# Altium schematic sheet 12.RK3568_OSCPLLPMUIO.SchDoc
size 420 x 297 mm
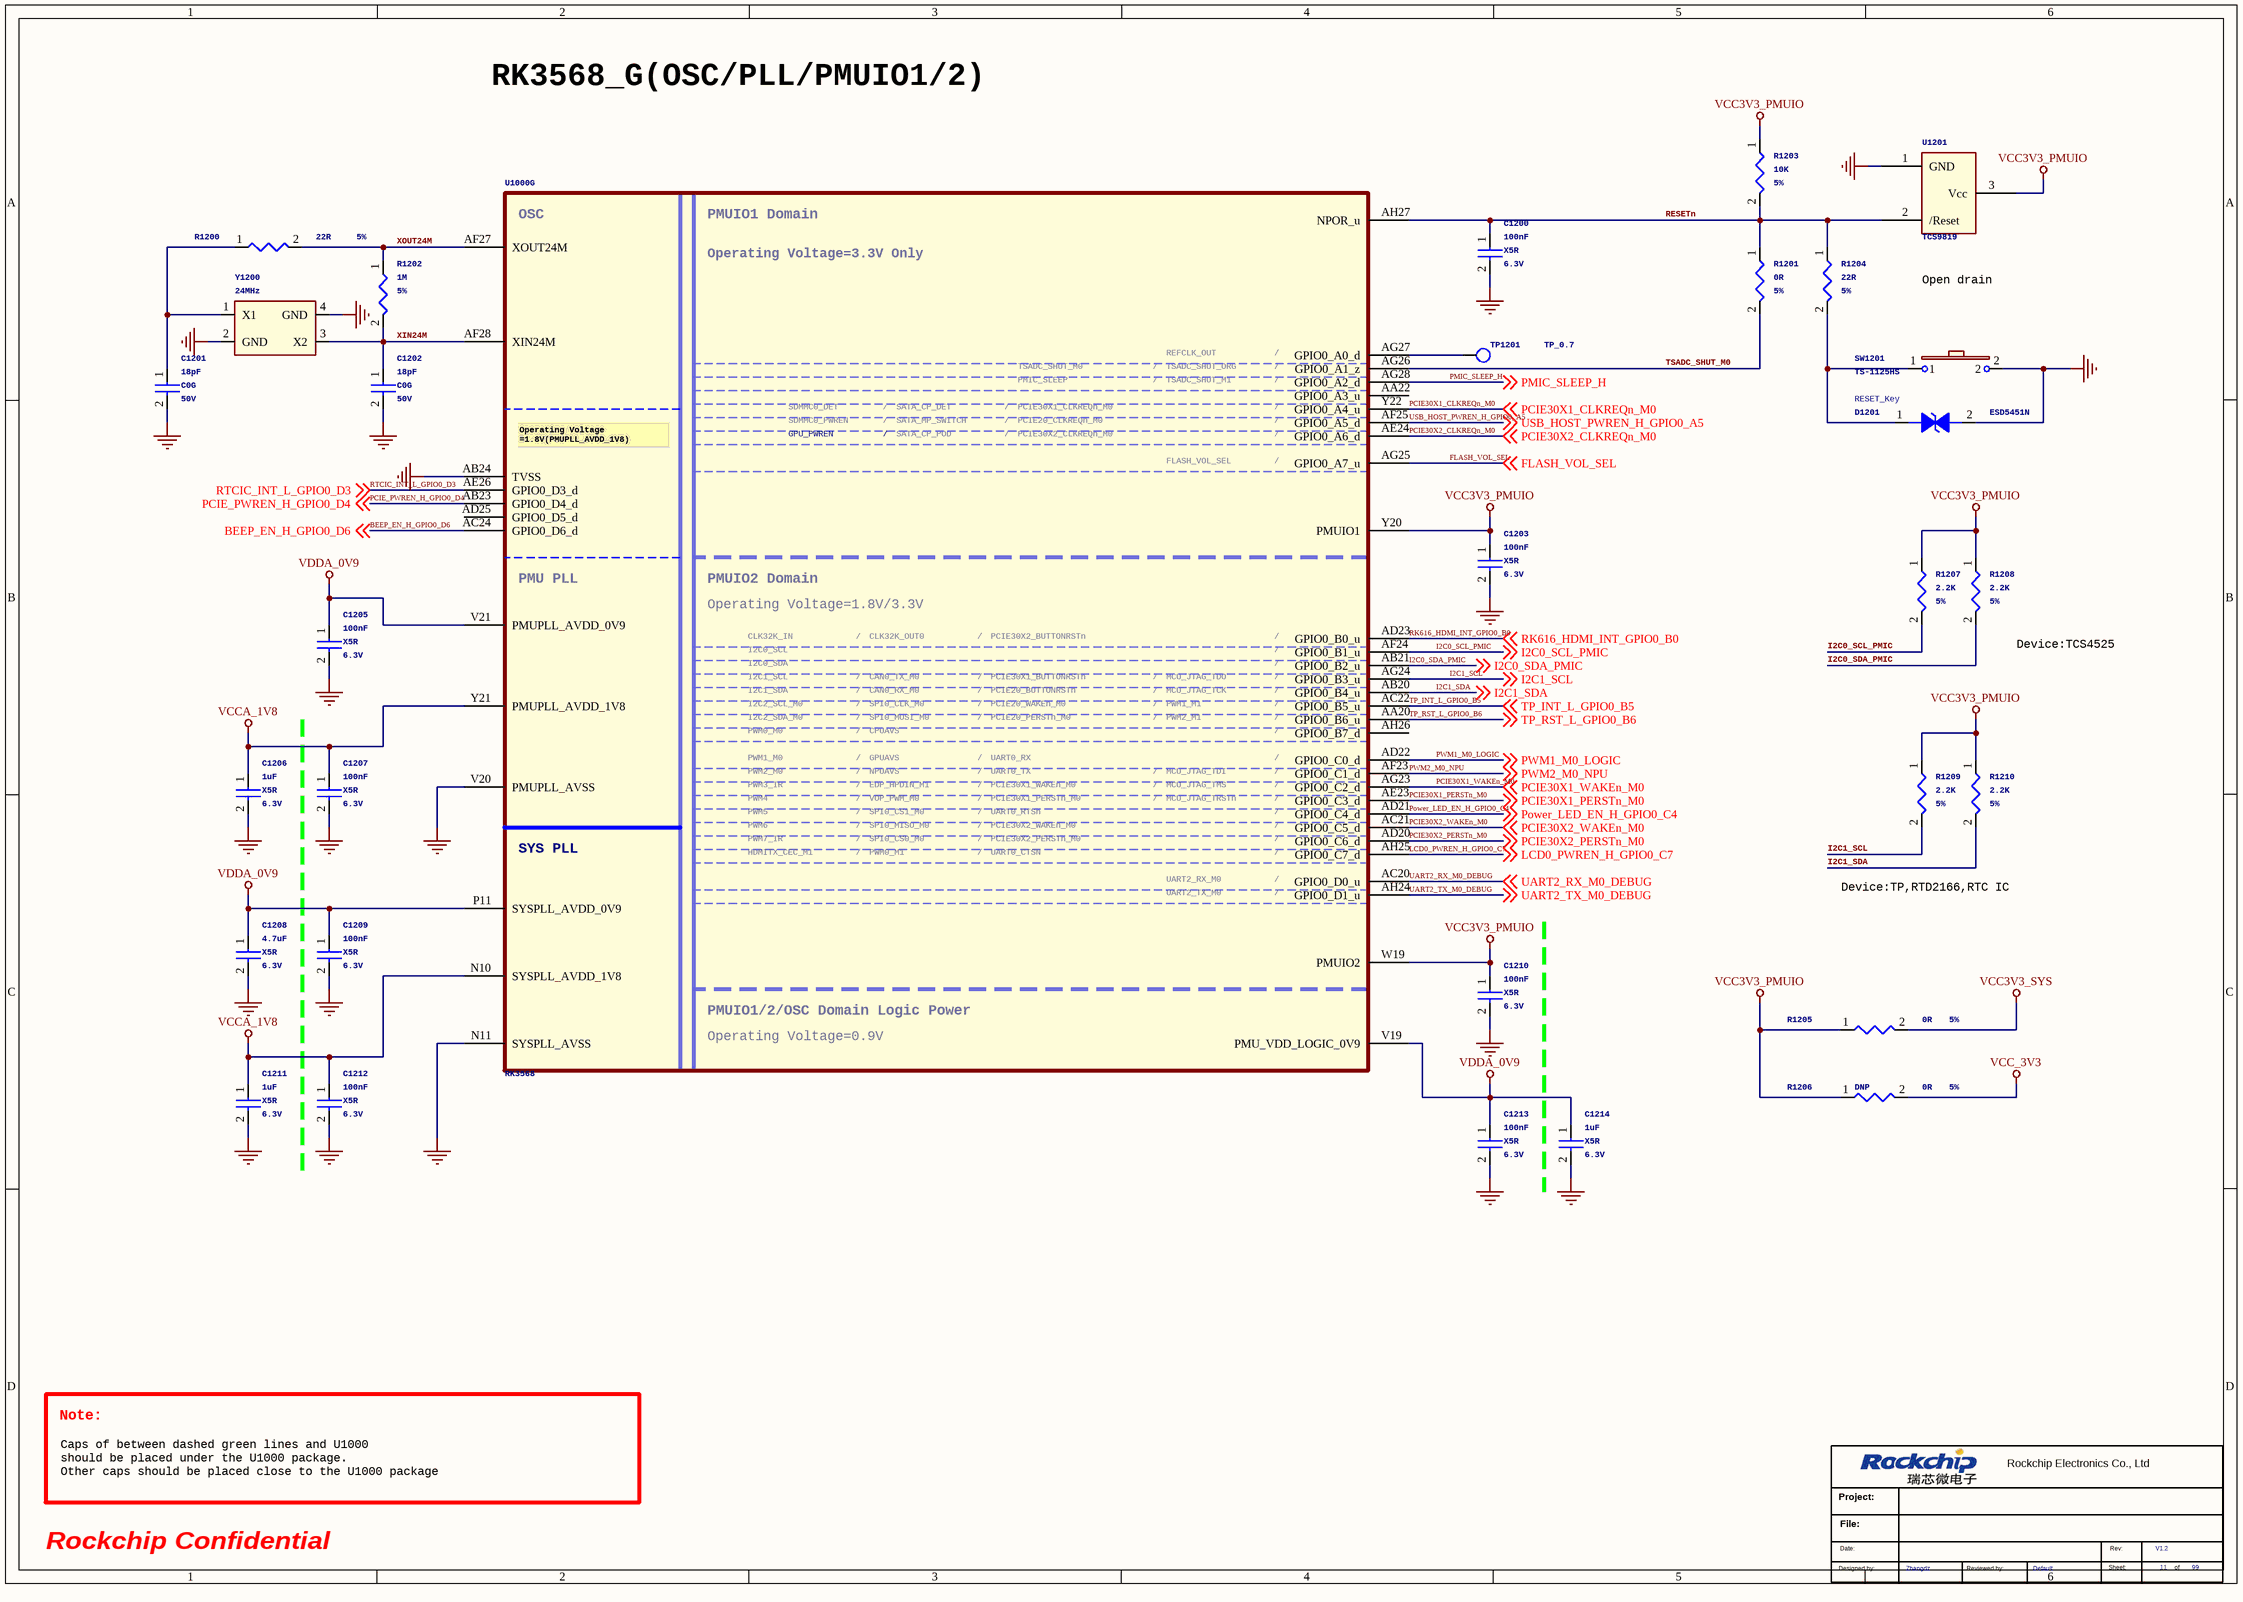
[diagram p0: 12.RK3568_OSCPLLPMUIO.SchDoc]

## Parts
*  Schematic Page Count: 99  Schematic Page Number: 11  Designer: Zhangdz  Revision: V1.2  Check: Default  (hidden comment: Rockchip_new)  (graphical)
C1200  100nF  Voltage: 6.3V  Dielectric: X5R  [C0201]
C1201  18pF  Voltage: 50V  Dielectric: C0G  [C0402]
C1202  18pF  Voltage: 50V  Dielectric: C0G  [C0402]
C1203  100nF  Voltage: 6.3V  Dielectric: X5R  [C0201]
C1205  100nF  Voltage: 6.3V  Dielectric: X5R  [C0201]
C1206  1uF  Voltage: 6.3V  Dielectric: X5R  [C0402]
C1207  100nF  Voltage: 6.3V  Dielectric: X5R  [C0201]
C1208  4.7uF  Voltage: 6.3V  Dielectric: X5R  [C0402]
C1209  100nF  Voltage: 6.3V  Dielectric: X5R  [C0201]
C1210  100nF  Voltage: 6.3V  Dielectric: X5R  [C0201]
C1211  1uF  Voltage: 6.3V  Dielectric: X5R  [C0402]
C1212  100nF  Voltage: 6.3V  Dielectric: X5R  [C0201]
C1213  100nF  Voltage: 6.3V  Dielectric: X5R  [C0201]
C1214  1uF  Voltage: 6.3V  Dielectric: X5R  [C0402]
D1201  ESD5451N  [ESD0402]
R1200  22R  Tolerance: 5%  [R0402]
R1201  0R  Tolerance: 5%  [R0402]
R1202  1M  Tolerance: 5%  [R0402]
R1203  10K  Tolerance: 5%  [R0402]
R1204  22R  Tolerance: 5%  [R0402]
R1205  0R  Tolerance: 5%  [R0402]
R1206  0R  Tolerance: 5%  option: DNP  [R0402]
R1207  2.2K  Tolerance: 5%  [R0402]
R1208  2.2K  Tolerance: 5%  [R0402]
R1209  2.2K  Tolerance: 5%  [R0402]
R1210  2.2K  Tolerance: 5%  [R0402]
SW1201  TS-1125HS  Option: RESET_Key  [SW2_6R00X3R70X2R50]
TP1201  TP_0.7  [TP_0R70]
U1000  RK3568  [BGA636_19R00X19R00X1R20]  (part G of 23)
U1201  TCS9819  [SOT_23]
Y1200  24MHz  [CRY4_3R20X2R50X0R80]

## Nets
GND: C1200.2 C1201.2 C1202.2 C1203.2 C1205.2 C1206.2 C1207.2 C1208.2 C1209.2 C1210.2 C1211.2 C1212.2 C1213.2 C1214.2 D1201.2 SW1201.2 U1000.AB24(TVSS) U1000.N11(SYSPLL_AVSS) U1000.V20(PMUPLL_AVSS) U1201.1(GND) Y1200.2(GND) Y1200.4(GND)
VCC3V3_PMUIO: C1203.1 C1210.1 R1203.1 R1205.1 R1206.1 R1207.1 R1208.1 R1209.1 R1210.1 U1000.W19(PMUIO2) U1000.Y20(PMUIO1) U1201.3(Vcc)
VCC3V3_SYS: R1205.2
VCC_3V3: R1206.2
VCCA_1V8: C1206.1 C1207.1 C1211.1 C1212.1 U1000.N10(SYSPLL_AVDD_1V8) U1000.Y21(PMUPLL_AVDD_1V8)
VDDA_0V9: C1205.1 C1208.1 C1209.1 C1213.1 C1214.1 U1000.P11(SYSPLL_AVDD_0V9) U1000.V19(PMU_VDD_LOGIC_0V9) U1000.V21(PMUPLL_AVDD_0V9)
BEEP_EN_H_GPIO0_D6: U1000.AC24(GPIO0_D6_d) ; off-sheet BEEP_EN_H_GPIO0_D6
FLASH_VOL_SEL: U1000.AG25(GPIO0_A7_u) ; off-sheet FLASH_VOL_SEL
I2C0_SCL_PMIC: R1207.2 U1000.AF24(GPIO0_B1_u) ; off-sheet I2C0_SCL_PMIC
I2C0_SDA_PMIC: R1208.2 U1000.AB21(GPIO0_B2_u) ; off-sheet I2C0_SDA_PMIC
I2C1_SCL: R1209.2 U1000.AG24(GPIO0_B3_u) ; off-sheet I2C1_SCL
I2C1_SDA: R1210.2 U1000.AB20(GPIO0_B4_u) ; off-sheet I2C1_SDA
LCD0_PWREN_H_GPIO0_C7: U1000.AH25(GPIO0_C7_d) ; off-sheet LCD0_PWREN_H_GPIO0_C7
PCIE30X1_CLKREQn_M0: U1000.Y22(GPIO0_A4_u) ; off-sheet PCIE30X1_CLKREQn_M0
PCIE30X1_PERSTn_M0: U1000.AE23(GPIO0_C3_d) ; off-sheet PCIE30X1_PERSTn_M0
PCIE30X1_WAKEn_M0: U1000.AG23(GPIO0_C2_d) ; off-sheet PCIE30X1_WAKEn_M0
PCIE30X2_CLKREQn_M0: U1000.AE24(GPIO0_A6_d) ; off-sheet PCIE30X2_CLKREQn_M0
PCIE30X2_PERSTn_M0: U1000.AD20(GPIO0_C6_d) ; off-sheet PCIE30X2_PERSTn_M0
PCIE30X2_WAKEn_M0: U1000.AC21(GPIO0_C5_d) ; off-sheet PCIE30X2_WAKEn_M0
PCIE_PWREN_H_GPIO0_D4: U1000.AB23(GPIO0_D4_d) ; off-sheet PCIE_PWREN_H_GPIO0_D4
PMIC_SLEEP_H: U1000.AG28(GPIO0_A2_d) ; off-sheet PMIC_SLEEP_H
Power_LED_EN_H_GPIO0_C4: U1000.AD21(GPIO0_C4_d) ; off-sheet Power_LED_EN_H_GPIO0_C4
PWM1_M0_LOGIC: U1000.AD22(GPIO0_C0_d) ; off-sheet PWM1_M0_LOGIC
PWM2_M0_NPU: U1000.AF23(GPIO0_C1_d) ; off-sheet PWM2_M0_NPU
RESETn: C1200.1 R1201.1 R1203.2 R1204.1 U1000.AH27(NPOR_u) U1201.2(/Reset)
RK616_HDMI_INT_GPIO0_B0: U1000.AD23(GPIO0_B0_u) ; off-sheet RK616_HDMI_INT_GPIO0_B0
RTCIC_INT_L_GPIO0_D3: U1000.AE26(GPIO0_D3_d) ; off-sheet RTCIC_INT_L_GPIO0_D3
TP_INT_L_GPIO0_B5: U1000.AC22(GPIO0_B5_u) ; off-sheet TP_INT_L_GPIO0_B5
TP_RST_L_GPIO0_B6: U1000.AA20(GPIO0_B6_u) ; off-sheet TP_RST_L_GPIO0_B6
TSADC_SHUT_M0: R1201.2 U1000.AG26(GPIO0_A1_z)
UART2_RX_M0_DEBUG: U1000.AC20(GPIO0_D0_u) ; off-sheet UART2_RX_M0_DEBUG
UART2_TX_M0_DEBUG: U1000.AH24(GPIO0_D1_u) ; off-sheet UART2_TX_M0_DEBUG
USB_HOST_PWREN_H_GPIO0_A5: U1000.AF25(GPIO0_A5_d) ; off-sheet USB_HOST_PWREN_H_GPIO0_A5
XIN24M: C1202.1 R1202.2 U1000.AF28(XIN24M) Y1200.3(X2)
XOUT24M: R1200.2 R1202.1 U1000.AF27(XOUT24M)
NetC1201_1: C1201.1 R1200.1 Y1200.1(X1)
NetD1201_1: D1201.1 R1204.2 SW1201.1
NetTP1201_1: TP1201.1 U1000.AG27(GPIO0_A0_d)

Not connected (* = marked no-connect by the designer): U1000 AA22(GPIO0_A3_u) AD25(GPIO0_D5_d) AH26(GPIO0_B7_d)

## Notes on the sheet
- RK3568_G(OSC/PLL/PMUIO1/2)
- Open drain
- (near R1208) Device:TCS4525
- Device:TP,RTD2166,RTC IC
- Note:
- Caps of between dashed green lines and U1000
  should be placed under the U1000 package.
  Other caps should be placed close to the U1000 package
- Rockchip Confidential
- (in symbol Rockchip_new) Rockchip Electronics Co., Ltd; Project:; File:; Date:; Rev:; Sheet:; of; Designed by:; Reviewed by:
- (in symbol SOC_RK3568, part G) OSC; PMUIO1 Domain; Operating Voltage=3.3V Only; REFCLK_OUT; /; TSADC_SHUT_M0; TSADC_SHUT_ORG; PMIC_SLEEP; TSADC_SHUT_M1; SDMMC0_DET; SATA_CP_DET; PCIE30X1_CLKREQn_M0; SDMMC0_PWREN; SATA_MP_SWITCH; PCIE20_CLKREQn_M0; GPU_PWREN; SATA_CP_POD; PCIE30X2_CLKREQn_M0; Operating Voltage / =1.8V(PMUPLL_AVDD_1V8); FLASH_VOL_SEL; PMU PLL; PMUIO2 Domain; Operating Voltage=1.8V/3.3V; CLK32K_IN; CLK32K_OUT0; PCIE30X2_BUTTONRSTn; I2C0_SCL; I2C0_SDA; I2C1_SCL; CAN0_TX_M0; PCIE30X1_BUTTONRSTn; MCU_JTAG_TDO; I2C1_SDA; CAN0_RX_M0; PCIE20_BUTTONRSTn; MCU_JTAG_TCK; I2C2_SCL_M0; SPI0_CLK_M0; PCIE20_WAKEn_M0; PWM1_M1; I2C2_SDA_M0; SPI0_MOSI_M0; PCIE20_PERSTn_M0; PWM2_M1; PWM0_M0; CPUAVS; PWM1_M0; GPUAVS; UART0_RX; PWM2_M0; NPUAVS; UART0_TX; MCU_JTAG_TDI; PWM3_IR; EDP_HPDIN_M1; PCIE30X1_WAKEn_M0; MCU_JTAG_TMS; PWM4; VOP_PWM_M0; PCIE30X1_PERSTn_M0; MCU_JTAG_TRSTn; PWM5; SPI0_CS1_M0; UART0_RTSn; PWM6; SPI0_MISO_M0; PCIE30X2_WAKEn_M0; PWM7_IR; SPI0_CS0_M0; PCIE30X2_PERSTn_M0; SYS PLL; HDMITX_CEC_M1; PWM0_M1; UART0_CTSN; UART2_RX_M0; UART2_TX_M0; PMUIO1/2/OSC Domain Logic Power; Operating Voltage=0.9V

## Library data of the parts
* = Rockchip_new: Page Number: 9; Page Count: 37; Revcode: V1.2
C1200 C1207 C1212 C1213 = CAP NP: cap,100.00nF,+/-10%,6.3V,X5R,C0201; Manufacturer: TDK; RK PN: C0603X5R0J104K030BC; Priority: A; Tolerance: 10%; Part Type: C0201; Manufacturer PN: C0603X5R0J104K030BC; Created by: JJJ
C1201 = CAP NP: cap,18.00pF,+/-5%,50V,C0G,C0402; Manufacturer: TDK; Number: 37; RK PN: C1005C0G1H180J050BA; Priority: A; Tolerance: 5%; C_Voltage: 6.3V; Part Type: C0402; Manufacturer PN: C1005C0G1H180J050BA; Created by: JJJ
C1202 = CAP NP: cap,18.00pF,+/-5%,50V,C0G,C0402; Manufacturer PN: C1005C0G1H180J050BA; Manufacturer: TDK; C_Voltage: 6.3V; Tolerance: 5%; Priority: A; Number: 37; Created by: JJJ; Part Type: C0402; RK PN: C1005C0G1H180J050BA
C1203 C1205 C1209 C1210 = CAP NP: cap,100.00nF,+/-10%,6.3V,X5R,C0201; Manufacturer PN: C0603X5R0J104K030BC; Manufacturer: TDK; Tolerance: 10%; Priority: A; Created by: JJJ; Part Type: C0201; RK PN: C0603X5R0J104K030BC
C1206 C1211 = CAP NP: cap,1.00uF,+/-10%,6.3V,X5R,C0402; Manufacturer PN: C1005X5R0J105K050BB; Manufacturer: TDK; Tolerance: 10%; Priority: A; Created by: JJJ; Part Type: C0402; RK PN: C1005X5R0J105K050BB
C1208 = CAP NP: cap,4.70uF,+/-10%,6.3V,X5R,C0402; Manufacturer: TDK; RK PN: C1005X5R0J475K050BC; Priority: A; Tolerance: 10%; Part Type: C0402; Manufacturer PN: C1005X5R0J475K050BC; Created by: JJJ
C1214 = CAP NP: cap,1.00uF,+/-10%,6.3V,X5R,C0402; Manufacturer: TDK; RK PN: C1005X5R0J105K050BB; Priority: A; Tolerance: 10%; Part Type: C0402; Manufacturer PN: C1005X5R0J105K050BB; Created by: JJJ
D1201 = DIODE BI_DIR TRIG: 1-Line, Bi-directional, Transient Voltage Suppressors.17.5pF.; Manufacturer: WillSemi(韦尔半导体); Priority: A; Created by: JJJ; Manufacturer PN: ESD5451N; Part Type: ESD_TVS; RK PN: ESD5451N
R1200 = RESISTOR: 通用厚膜电阻,22R,+/-5%,R0402,1/16W.; Manufacturer: YAGEO; RK PN: RC0402JR-0722RL; Priority: A; Wattage: 1/16W; Part Type: 通用厚膜电阻; Manufacturer PN: RC0402JR-0722RL; Created by: YTL
R1201 = RESISTOR: 通用厚膜电阻,0R,+/-5%,R0402,1/16W.; Manufacturer: YAGEO; RK PN: RC0402JR-070RL; Priority: A; Wattage: 1/16W; Part Type: 通用厚膜电阻; Manufacturer PN: RC0402JR-070RL; Created by: YTL
R1202 = RESISTOR: 通用厚膜电阻,1M,+/-5%,R0402,1/16W.; Manufacturer: YAGEO; RK PN: RC0402JR-071ML; Priority: A; Wattage: 1/16W; Part Type: 通用厚膜电阻; Manufacturer PN: RC0402JR-071ML; Created by: YTL
R1203 = RESISTOR: 通用厚膜电阻,10K,+/-5%,R0402,1/16W.; Manufacturer PN: RC0402JR-0710KL; Manufacturer: YAGEO; Wattage: 1/16W; Priority: A; Created by: YTL; Part Type: 通用厚膜电阻; RK PN: RC0402JR-0710KL
R1204 = RESISTOR: 通用厚膜电阻,22R,+/-5%,R0402,1/16W.; Manufacturer PN: RC0402JR-0722RL; Manufacturer: YAGEO; Wattage: 1/16W; Priority: A; Created by: YTL; Part Type: 通用厚膜电阻; RK PN: RC0402JR-0722RL
R1205 R1206 = RESISTOR: 通用厚膜电阻,0R,+/-5%,R0402,1/16W.; Manufacturer PN: RC0402JR-070RL; Manufacturer: YAGEO; Wattage: 1/16W; Priority: A; Created by: YTL; Part Type: 通用厚膜电阻; RK PN: RC0402JR-070RL
R1207 R1208 = RESISTOR: 通用厚膜电阻,2K2,+/-5%,R0402,1/16W.; Manufacturer PN: RC0402JR-072K2L; Manufacturer: YAGEO; Wattage: 1/16W; Priority: A; Created by: YTL; Part Type: 通用厚膜电阻; RK PN: RC0402JR-072K2L
R1209 R1210 = RESISTOR: 通用厚膜电阻,2K2,+/-5%,R0402,1/16W.; Manufacturer: YAGEO; RK PN: RC0402JR-072K2L; Priority: A; Wattage: 1/16W; Part Type: 通用厚膜电阻; Manufacturer PN: RC0402JR-072K2L; Created by: YTL
SW1201 = KEY_2PIN: 2脚贴片，6MMx3.7MM按键; Manufacturer: 褀华电子; Priority: A; RK PN: TS-1125HS; Part Type: KEY; Manufacturer Part Number: TS-1125HS; Created by: YWQ
TP1201 = TP: Test Point 0.7mm; RK PN: TESTPOINT_0R7; Priority: A; Part Type: TP; Created by: JJJ
U1000 = SOC_RK3568: ROCKCHIP SOC; Manufacturer: Rockchip (瑞芯微); SPLIT_INST: TRUE; SWAP_INFO: (S1+S2+S3+S4+S5+S6+S7+S8+S9+S10+S11+S12+S13+S14+S15+S16+S17+S18+S19+S20+S21+S22+S23); Priority: A; RK PN: RK3568; Part Type: SOC; Manufacturer PN: RK3568; Created by: JJJ
U1201 = Voltage_Detector_CE8809: Ultra-Small Built-In Delay High-Precision Voltage Detector; Manufacturer: Chipower（芯力微）; RK PN: CE8809C263MA; Priority: A; Part Type: Voltage_Detectors; Manufacturer PN: CE8809C263MA; Created by: JJJ
Y1200 = CRYSTAL_4P: 无源晶振，24M，3225,±10ppm，8pF，Hosonic; Manufacturer: Hosonic(鸿星电子); RK PN: E3SB24.0000F08E11; Priority: A; Part Type: CRYSTAL; Manufacturer PN: E3SB24.0000F08E11; Created by: JJJ